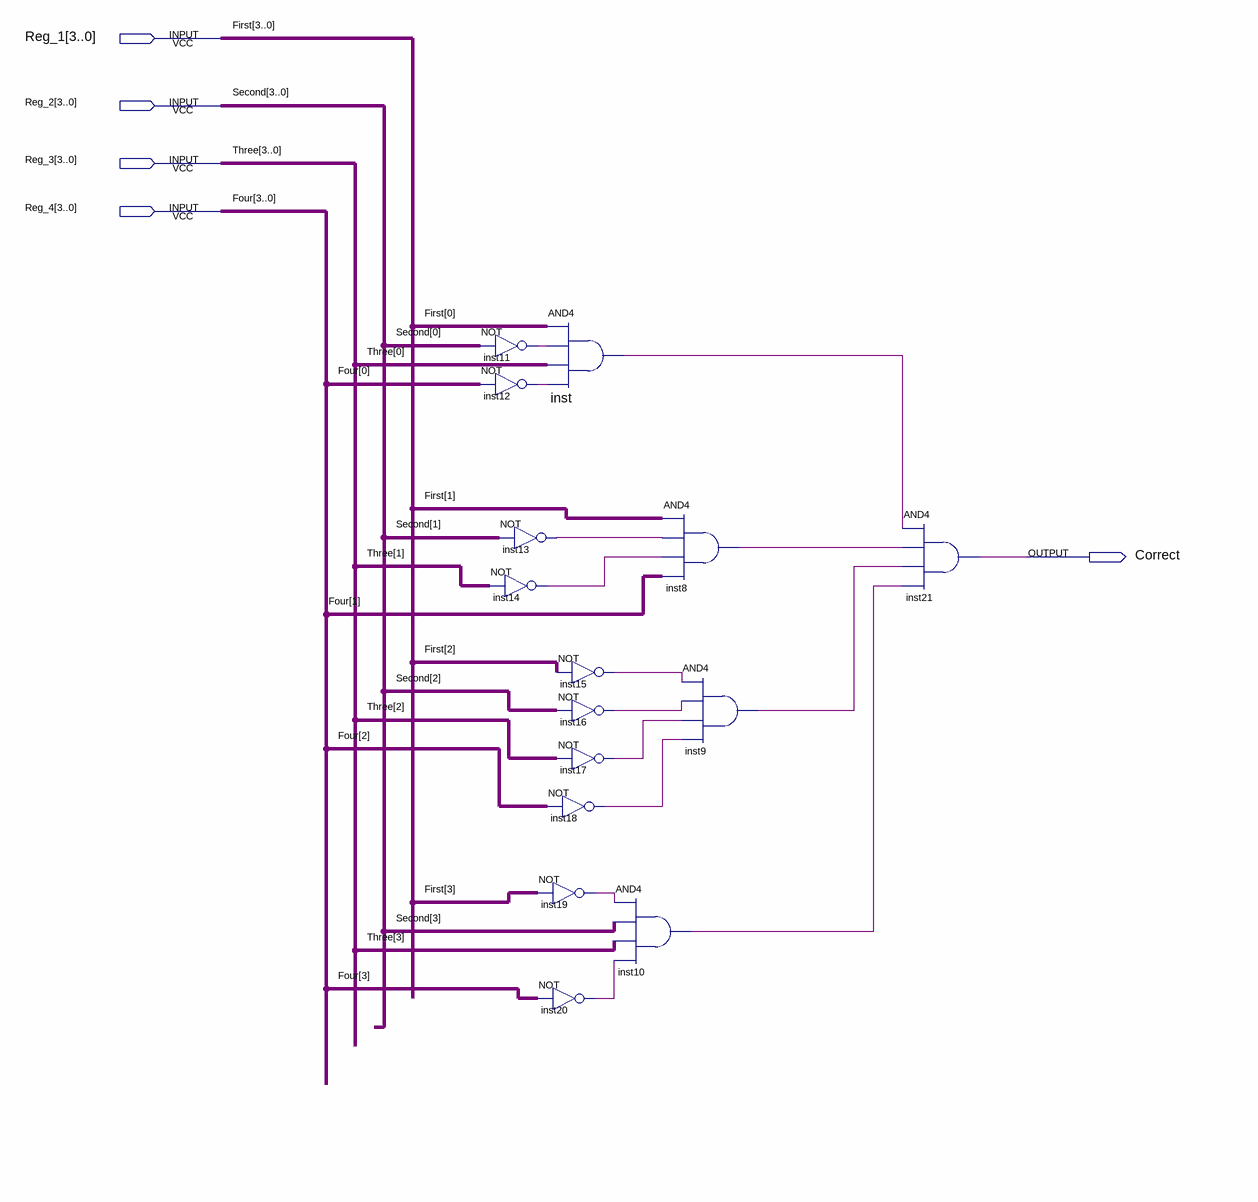
[diagram p0: schematic sheet]
// Quartus schematic Password.bdf as structural Verilog: 15 symbols, 5 pins
module Password (
  input  [3:0] Reg_1,
  input  [3:0] Reg_2,
  input  [3:0] Reg_3,
  input  [3:0] Reg_4,
  output Correct
);

  wire inst8_out, inst9_out, inst10_out, inst11_out, inst12_out, inst13_out, inst14_out, inst15_out,
       inst16_out, inst17_out, inst18_out, inst19_out, inst20_out, inst_out;

  and inst (inst_out, Reg_1[0], inst11_out, Reg_3[0], inst12_out);
  not inst11 (inst11_out, Reg_2[0]);
  not inst12 (inst12_out, Reg_4[0]);
  not inst13 (inst13_out, Reg_2[1]);
  not inst14 (inst14_out, Reg_3[1]);
  not inst18 (inst18_out, Reg_4[2]);
  not inst19 (inst19_out, Reg_1[3]);
  not inst20 (inst20_out, Reg_4[3]);
  not inst15 (inst15_out, Reg_1[2]);
  not inst16 (inst16_out, Reg_2[2]);
  not inst17 (inst17_out, Reg_3[2]);
  and inst10 (inst10_out, inst19_out, Reg_2[3], Reg_3[3], inst20_out);
  and inst8 (inst8_out, Reg_1[1], inst13_out, inst14_out, Reg_4[1]);
  and inst9 (inst9_out, inst15_out, inst16_out, inst17_out, inst18_out);
  and inst21 (Correct, inst_out, inst8_out, inst9_out, inst10_out);

  // Other names for the same wires on the sheet: First[3:0] = Reg_1; Four[3:0] = Reg_4; Second[3:0] = Reg_2;
  //   Three[3:0] = Reg_3
endmodule
